# Altium schematic sheet Sheet1.SchDoc
size 420 x 297 mm; Razrabotal: {Разработал}; Prov: {Проверил}; Tkont: {Т. конт.}; Nkont: {Н. конт.}; Utv: {Утвердил}; Naimenovanie: {Наименование}; Oboznachenie: {Обозначение}; Shifr: {Шифр}
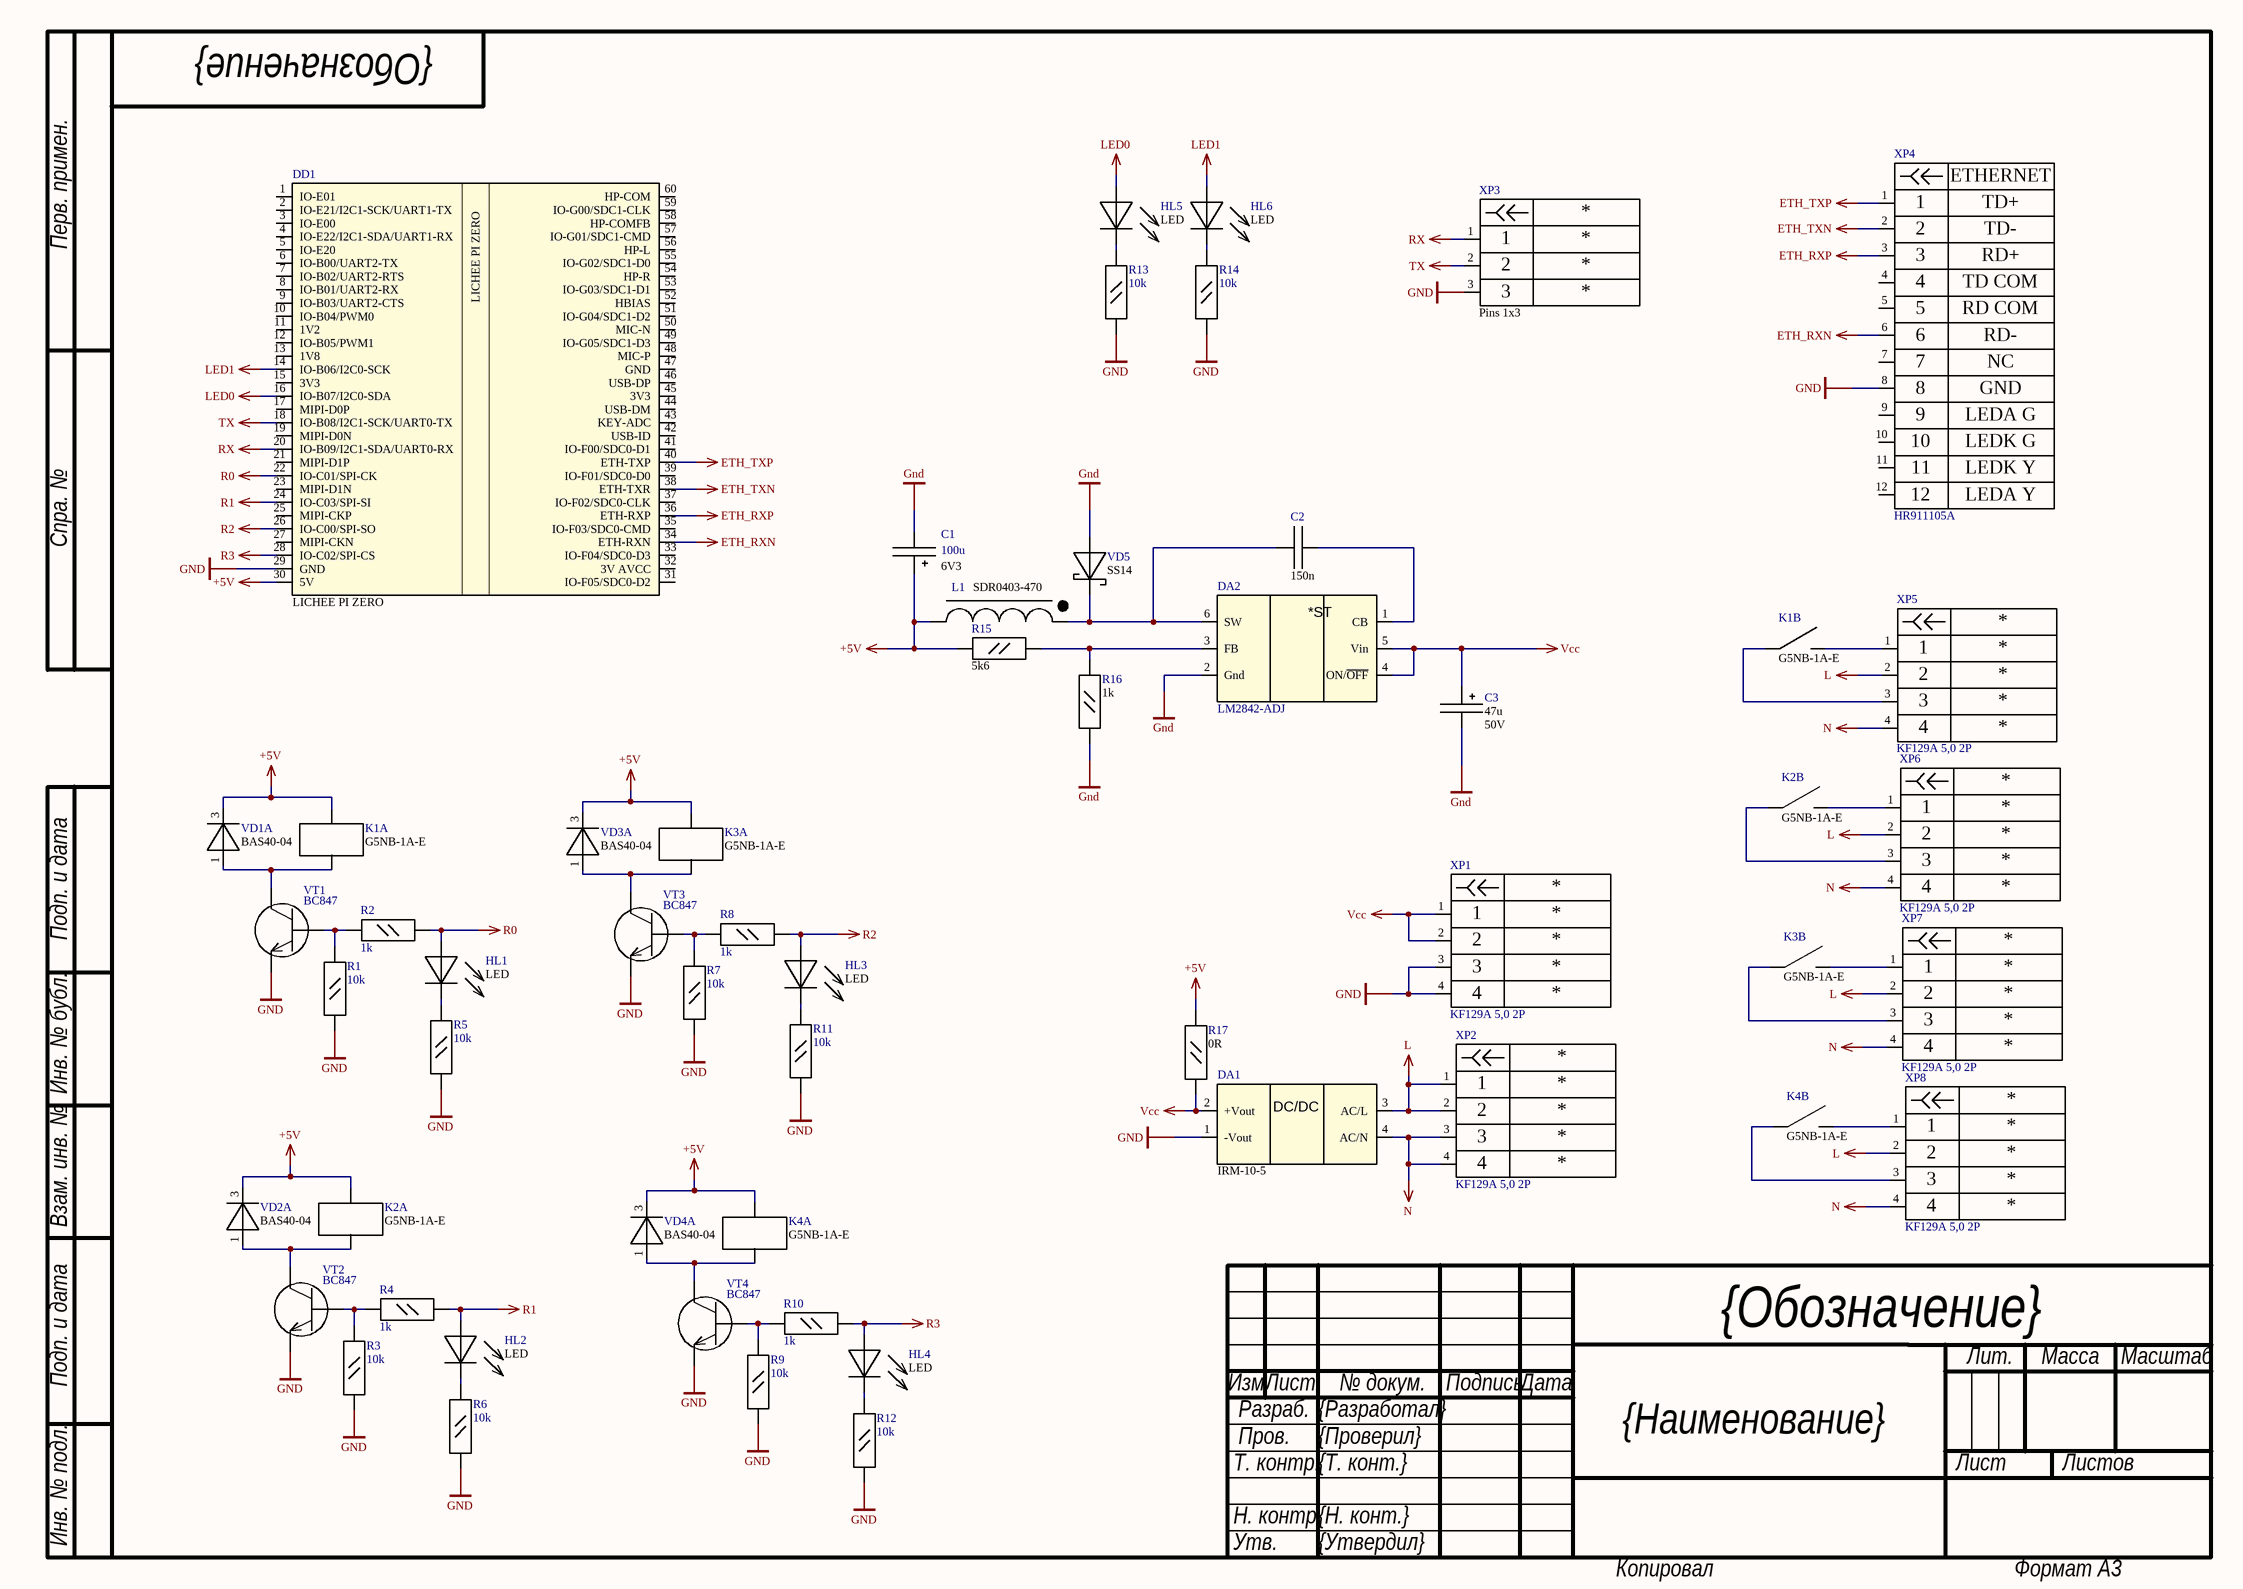
[diagram p0: Sheet1.SchDoc]

## Parts
C1  100u  Comments: 6V3  [TECap D]
C2  150n  [Cap Ceramic 0805]
C3  47u  Comments: 50V  [Cap electro d6.3x2.54mm]
DA1  IRM-10-5  [IRM-10-xx]
DA2  LM2842-ADJ  [SOT-23-6_2]
DD1  LICHEE PI ZERO  [lichee pi zero]
HL1  LED  [LED 0805]
HL2  LED  [LED 0805]
HL3  LED  [LED 0805]
HL4  LED  [LED 0805]
HL5  LED  [LED 0805]
HL6  LED  [LED 0805]
K1  G5NB-1A-E  [G5NB1AE]  (parts A,B of 2)
K2  G5NB-1A-E  [G5NB1AE]  (parts A,B of 2)
K3  G5NB-1A-E  [G5NB1AE]  (parts A,B of 2)
K4  G5NB-1A-E  [G5NB1AE]  (parts A,B of 2)
L1  SDR0403-470  [SDR0403]
R1  10k  [Resistor 0805]
R2  1k  [Resistor 0805]
R3  10k  [Resistor 0805]
R4  1k  [Resistor 0805]
R5  10k  [Resistor 0805]
R6  10k  [Resistor 0805]
R7  10k  [Resistor 0805]
R8  1k  [Resistor 0805]
R9  10k  [Resistor 0805]
R10  1k  [Resistor 0805]
R11  10k  [Resistor 0805]
R12  10k  [Resistor 0805]
R13  10k  [Resistor 0805]
R14  10k  [Resistor 0805]
R15  5k6  [Resistor 0805]
R16  1k  [Resistor 0805]
R17  0R  [Resistor 0805]
VD1  BAS40-04  [SOT-23-3]  (part A of 2)
VD2  BAS40-04  [SOT-23-3]  (part A of 2)
VD3  BAS40-04  [SOT-23-3]  (part A of 2)
VD4  BAS40-04  [SOT-23-3]  (part A of 2)
VD5  SS14  [DO-214AC SMA]
VT1  BC847  [SOT-23-3]
VT2  BC847  [SOT-23-3]
VT3  BC847  [SOT-23-3]
VT4  BC847  [SOT-23-3]
XP1  KF129A 5,0 2P  [KF129A 5,0 2P]
XP2  KF129A 5,0 2P  [KF129A 5,0 2P]
XP3  Pins 1x3  [Pins 1x3]
XP4  HR911105A  Name1: TD+  Name2: TD-  Name3: RD+  Name: ETHERNET  Name4: TD COM  Name5: RD COM  Name6: RD-  Name7: NC  Name8: GND  Name9: LEDA G  Name10: LEDK G  Name11: LEDK Y  Name12: LEDA Y  [HR911105A]
XP5  KF129A 5,0 2P  [KF129A 5,0 2P]
XP6  KF129A 5,0 2P  [KF129A 5,0 2P]
XP7  KF129A 5,0 2P  [KF129A 5,0 2P]
XP8  KF129A 5,0 2P  [KF129A 5,0 2P]

## Nets
+5V: C1.2 DD1.30(5V) K1.1 K2.1 K3.1 K4.1 L1.2 R15.2 R17.2 VD1.3(K/A) VD2.3(K/A) VD3.3(K/A) VD4.3(K/A)
ETH_RXN: DD1.34(ETH-RXN) XP4.6
ETH_RXP: DD1.36(ETH-RXP) XP4.3
ETH_TXN: DD1.38(ETH-TXR) XP4.2
ETH_TXP: DD1.40(ETH-TXP) XP4.1
GND: C1.1 C3.1 DA1.1(-Vout) DA2.2(Gnd) DD1.29(GND) R1.1 R3.1 R5.1 R6.1 R7.1 R9.1 R11.1 R12.1 R13.1 R14.1 R16.1 VD5.1(A) VT1.2(E) VT2.2(E) VT3.2(E) VT4.2(E) XP1.3 XP1.4 XP3.3 XP4.8
L: DA1.3(AC/L) XP2.1 XP2.2 XP5.2 XP6.2 XP7.2 XP8.2
LED0: DD1.16(IO-B07/I2C0-SDA) HL5.1(A)
LED1: DD1.14(IO-B06/I2C0-SCK) HL6.1(A)
N: DA1.4(AC/N) XP2.3 XP2.4 XP5.4 XP6.4 XP7.4 XP8.4
R0: DD1.22(IO-C01/SPI-CK) HL1.1(A) R2.2
R1: DD1.24(IO-C03/SPI-SI) HL2.1(A) R4.2
R2: DD1.26(IO-C00/SPI-SO) HL3.1(A) R8.2
R3: DD1.28(IO-C02/SPI-CS) HL4.1(A) R10.2
RX: DD1.20(IO-B09/I2C1-SDA/UART0-RX) XP3.1
TX: DD1.18(IO-B08/I2C1-SCK/UART0-TX) XP3.2
Vcc: C3.2 DA1.2(+Vout) DA2.4(ON/~{OFF}) DA2.5(Vin) R17.1 XP1.1 XP1.2
NetC2_1: C2.1 DA2.1(CB)
NetC2_2: C2.2 DA2.6(SW) L1.1 VD5.2(K)
NetDA2_3: DA2.3(FB) R15.1 R16.2
NetHL1_2: HL1.2(K) R5.2
NetHL2_2: HL2.2(K) R6.2
NetHL3_2: HL3.2(K) R11.2
NetHL4_2: HL4.2(K) R12.2
NetHL5_2: HL5.2(K) R13.2
NetHL6_2: HL6.2(K) R14.2
NetK1_2: K1.2 VD1.1(A) VT1.3(K)
NetK1_3: K1.3 XP5.3
NetK1_4: K1.4 XP5.1
NetK2_2: K2.2 VD2.1(A) VT2.3(K)
NetK2_3: K2.3 XP6.3
NetK2_4: K2.4 XP6.1
NetK3_2: K3.2 VD3.1(A) VT3.3(K)
NetK3_3: K3.3 XP7.3
NetK3_4: K3.4 XP7.1
NetK4_2: K4.2 VD4.1(A) VT4.3(K)
NetK4_3: K4.3 XP8.3
NetK4_4: K4.4 XP8.1
NetR1_2: R1.2 R2.1 VT1.1(B)
NetR3_2: R3.2 R4.1 VT2.1(B)
NetR7_2: R7.2 R8.1 VT3.1(B)
NetR9_2: R9.2 R10.1 VT4.1(B)

Not connected (* = marked no-connect by the designer): DD1 1(IO-E01) 2(IO-E21/I2C1-SCK/UART1-TX) 3(IO-E00) 4(IO-E22/I2C1-SDA/UART1-RX) 5(IO-E20) 6(IO-B00/UART2-TX) 7(IO-B02/UART2-RTS) 8(IO-B01/UART2-RX) 9(IO-B03/UART2-CTS) 10(IO-B04/PWM0) 11(1V2) 12(IO-B05/PWM1) 13(1V8) 15(3V3) 17(MIPI-D0P) 19(MIPI-D0N) 21(MIPI-D1P) 23(MIPI-D1N) 25(MIPI-CKP) 27(MIPI-CKN) 31(IO-F05/SDC0-D2) 32(3V_AVCC) 33(IO-F04/SDC0-D3) 35(IO-F03/SDC0-CMD) 37(IO-F02/SDC0-CLK) 39(IO-F01/SDC0-D0) 41(IO-F00/SDC0-D1) 42(USB-ID) 43(KEY-ADC) 44(USB-DM) 45(3V3) 46(USB-DP) 47(GND) 48(MIC-P) 49(IO-G05/SDC1-D3) 50(MIC-N) 51(IO-G04/SDC1-D2) 52(HBIAS) 53(IO-G03/SDC1-D1) 54(HP-R) 55(IO-G02/SDC1-D0) 56(HP-L) 57(IO-G01/SDC1-CMD) 58(HP-COMFB) 59(IO-G00/SDC1-CLK) 60(HP-COM); XP4 4 5 7 9 10 11 12

## Notes on the sheet
- Перв. примен.
- Спра. №
- Подп. и дата
- Инв. № бубл.
- Взам. инв. №
- Изм
- Лист
- № докум.
- Подпись
- Дата
- Лит.
- Масса
- Масштаб
- Т. контр.
- Разраб.
- Пров.
- Листов
- Инв. № подл.
- Н. контр.
- Утв.
- Копировал
- Формат А3
- (in symbol IRM-10-xx) DC/DC
- (in symbol LM284x) *ST

## Library data of the parts
C1 = TECap
C2 = Capacitor Nonpolar: Comments: *
C3 = ECap
DA1 = IRM-10-xx
DA2 = LM284x: Comments: *
L1 = SDR0403-xxx
R1-R17 = Resistor 0,125W: Comments: *
HL1-HL6 = LED: Comments: *
K1-K4 = G5NB-1A-E: Comments: *
VD1-VD4 = BAS40-04: Comments: *
VD5 = SS14: Comments: *
VT1-VT4 = BC847: Comments: *
XP1 XP2 XP5-XP8 = KF129A 5,0 2P: Comments: *; Name1: *; Name2: *; Name3: *; Name: *; Name4: *
XP3 = Pins 1x3: Comments: *; Name1: *; Name: *; Name2: *; Name3: *
XP4 = HR911105A: Comments: *